# EAGLE design splitter (EAGLE 6.4)
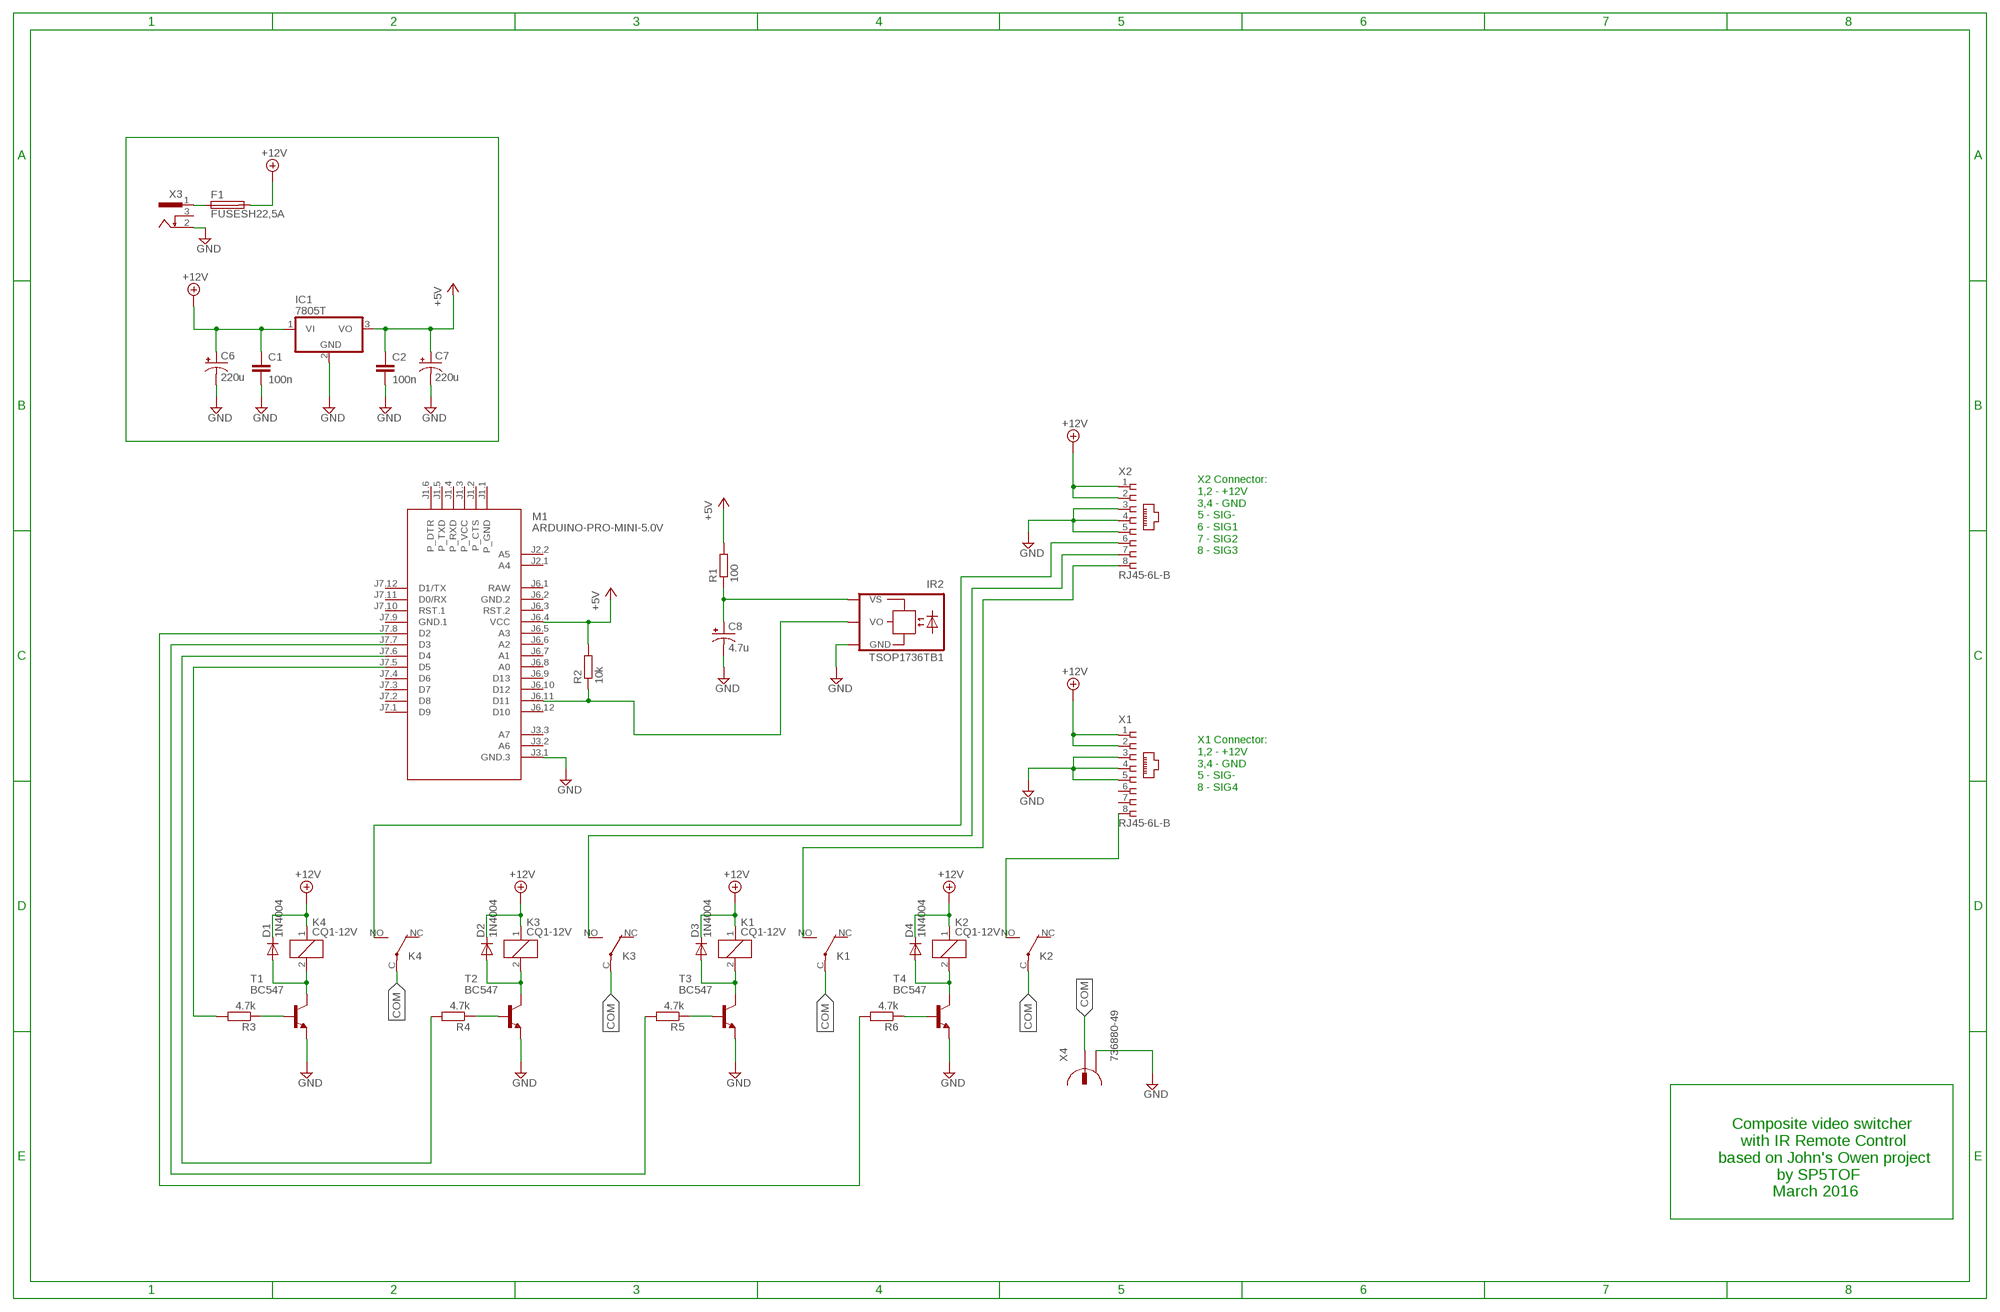
[diagram p0: schematic, sheet 1]

## Parts
C1  100n  C-EU025-024X044  [C025-024X044]
C2  100n  C-EU025-024X044  [C025-024X044]
C6  220u  CAP_POLPTH2  [CPOL-RADIAL-10UF-25V]
C7  220u  CAP_POLPTH2  [CPOL-RADIAL-10UF-25V]
C8  4.7u  CAP_POLPTH2  [CPOL-RADIAL-10UF-25V]
D1  1N4004  [DO41-10]
D2  1N4004  [DO41-10]
D3  1N4004  [DO41-10]
D4  1N4004  [DO41-10]
F1  FUSESH22,5A  [SH22,5A]
IC1  7805T  [TO220H]
IR2  TSOP1736TB1  [TSOP17_TB1]
K1  CQ1-12V  [CQ1]
K2  CQ1-12V  [CQ1]
K3  CQ1-12V  [CQ1]
K4  CQ1-12V  [CQ1]
M1  ARDUINO-PRO-MINI-5.0V  [ARDUINO-PRO-MINI]
R1  100  R-EU_0204/7  [0204/7]
R2  10k  R-EU_0204/7  [0204/7]
R3  4.7k  R-EU_0204/7  [0204/7]
R4  4.7k  R-EU_0204/7  [0204/7]
R5  4.7k  R-EU_0204/7  [0204/7]
R6  4.7k  R-EU_0204/7  [0204/7]
T1  BC547  [TO92]
T2  BC547  [TO92]
T3  BC547  [TO92]
T4  BC547  [TO92]
X1  RJ45-6L-B  [RJ45-NO-SHIELD]
X2  RJ45-6L-B  [RJ45-NO-SHIELD]
X3  733980-62  [733980-62]
X4  736880-49  [736880-49]

## Nets
+5V: C2.1 C7.1(+) IC1.3(VO) M1.J6.4(VCC) R1.2 R2.2
+12V: C1.1 C6.1(+) D1.C D2.C D3.C D4.C F1.2 IC1.1(VI) K1.1 K2.1 K3.1 K4.1 X1.1 X1.2 X2.1 X2.2
COM: K1.C(2:P) K2.C(2:P) K3.C(2:P) K4.C(2:P) X4.1
GND: C1.2 C2.2 C6.2(-) C7.2(-) C8.2(-) IC1.2(GND) IR2.GND M1.J3.1(GND.3) T1.1(E) T2.1(E) T3.1(E) T4.1(E) X1.3 X1.4 X1.5 X2.3 X2.4 X2.5 X3.2 X4.2
N$1: C8.1(+) IR2.VS R1.1
N$2: F1.1 X3.1
N$3: IR2.VO M1.J6.11(D11) R2.1
N$4: R3.1 T1.2(B)
N$5: R4.1 T2.2(B)
N$6: R5.1 T3.2(B)
N$7: R6.1 T4.2(B)
N$8: D1.A K4.2 T1.3(C)
N$9: M1.J7.7(D3) R5.2
N$10: M1.J7.6(D4) R4.2
N$11: D2.A K3.2 T2.3(C)
N$12: D3.A K1.2 T3.3(C)
N$13: D4.A K2.2 T4.3(C)
N$14: K4.NO(2:S) X2.6
N$15: K3.NO(2:S) X2.7
N$16: K1.NO(2:S) X2.8
N$17: K2.NO(2:S) X1.8
N$23: M1.J7.5(D5) R3.2
N$24: M1.J7.8(D2) R6.2
Unconnected: K1.NC(2:O) K2.NC(2:O) K3.NC(2:O) K4.NC(2:O) M1.J1.1(P_GND) M1.J1.2(P_CTS) M1.J1.3(P_VCC) M1.J1.4(P_RXD) M1.J1.5(P_TXD) M1.J1.6(P_DTR) M1.J2.1(A4) M1.J2.2(A5) M1.J3.2(A6) M1.J3.3(A7) M1.J6.3(RST.2) M1.J6.5(A3) M1.J6.6(A2) M1.J6.7(A1) M1.J6.8(A0) M1.J6.9(D13) M1.J6.10(D12) M1.J6.12(D10) M1.J7.1(D9) M1.J7.2(D8) M1.J7.3(D7) M1.J7.4(D6) M1.J7.10(RST.1) M1.J7.11(D0/RX) M1.J7.12(D1/TX) X1.6 X1.7 X3.3 X4.2@2

## Notes on the sheet
- X2 Connector:
  1,2 - +12V
  3,4 - GND
  5 - SIG-
  6 - SIG1
  7 - SIG2
  8 - SIG3
- X1 Connector:
  1,2 - +12V
  3,4 - GND
  5 - SIG-
  8 - SIG4
- Composite video switcher
          with IR Remote Control
     based on John's Owen project
                  by SP5TOF
                 March 2016

## Power pins joined to a net without a drawn wire
GND.1: M1.J7.9(GND.1)
GND.2: M1.J6.2(GND.2)
RAW: M1.J6.1(RAW)

## Library data of the parts
C1 C2 = rcl:C-EU: CAPACITOR, European symbol
C6-C8 = cyberdriver:CAP_POL: Capacitor Polarized These are standard SMD and PTH capacitors. Normally 10uF, 47uF, and 100uF in electrolytic and tantalum varieties. Always verify the external diameter of the through hole cap, it varies with capacity, voltage, and manufacturer. The EIA devices should be standard.
D1-D4 = diode:1N4004: DIODE general purpose rectifier, 1 A
F1 = fuse:FUSE: Fuse; OC_FARNELL: unknown; OC_NEWARK: unknown
IC1 = linear:78*: Positive VOLTAGE REGULATOR Source: http://cache.national.com/ds/LM/LM78L05.pdf http://www.fairchildsemi.com/ds/LM/LM7805.pdf
IR2 = telefunken:TSOP17*TB1: TSOP17..TB1 IR Receiver Modules for Remote Control Systems Source: http://www.vishay.com/docs/82042/82042.pdf; OC_FARNELL: unknown; OC_NEWARK: unknown
K1-K4 = relay:CQ1-12V: AUTOMOTIVE QUIET RELAY NAiS Source: http://www.mew-europe.com/.. en_ds_61208_0000.pdf; OC_FARNELL: unknown; OC_NEWARK: unknown
M1 = diy-modules:ARDUINO-PRO-MINI-*: Arduino Pro Mini
R1-R6 = rcl:R-EU_: RESISTOR, European symbol
T1-T4 = transistor:BC547: NPN TRANSISTOR
X1 X2 = con-tycoelectronics:RJ45: CORCOM Modular RJ Jacks No Shield Source: www.tycoelectronics.com .. ENG_DS_1654001_1099_RJ_L_0507.pdf; MPN: RJ45-6L-B; OC_FARNELL: unknown; OC_NEWARK: 16R6090
X3 = con-conrad:73398?: FEMALE PRINT CONNECTOR Niedervolt-Steckverbinder Distributor Conrad
X4 = con-conrad:736880-49: Cinch Connector ( RCA Jack )

## Board
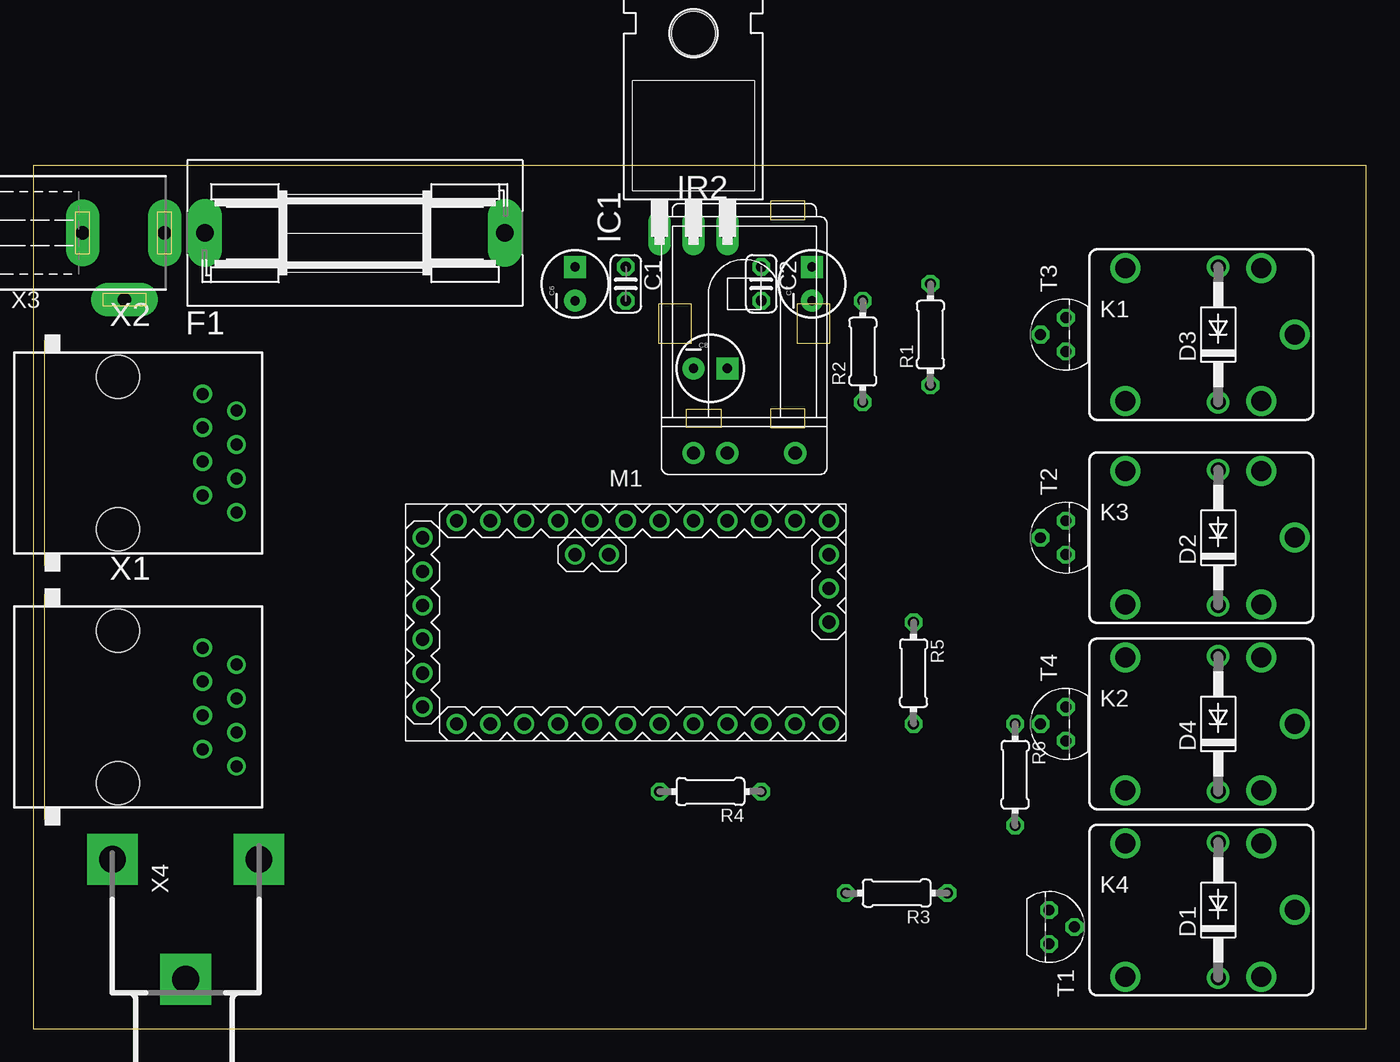
[diagram p1: board, top side]
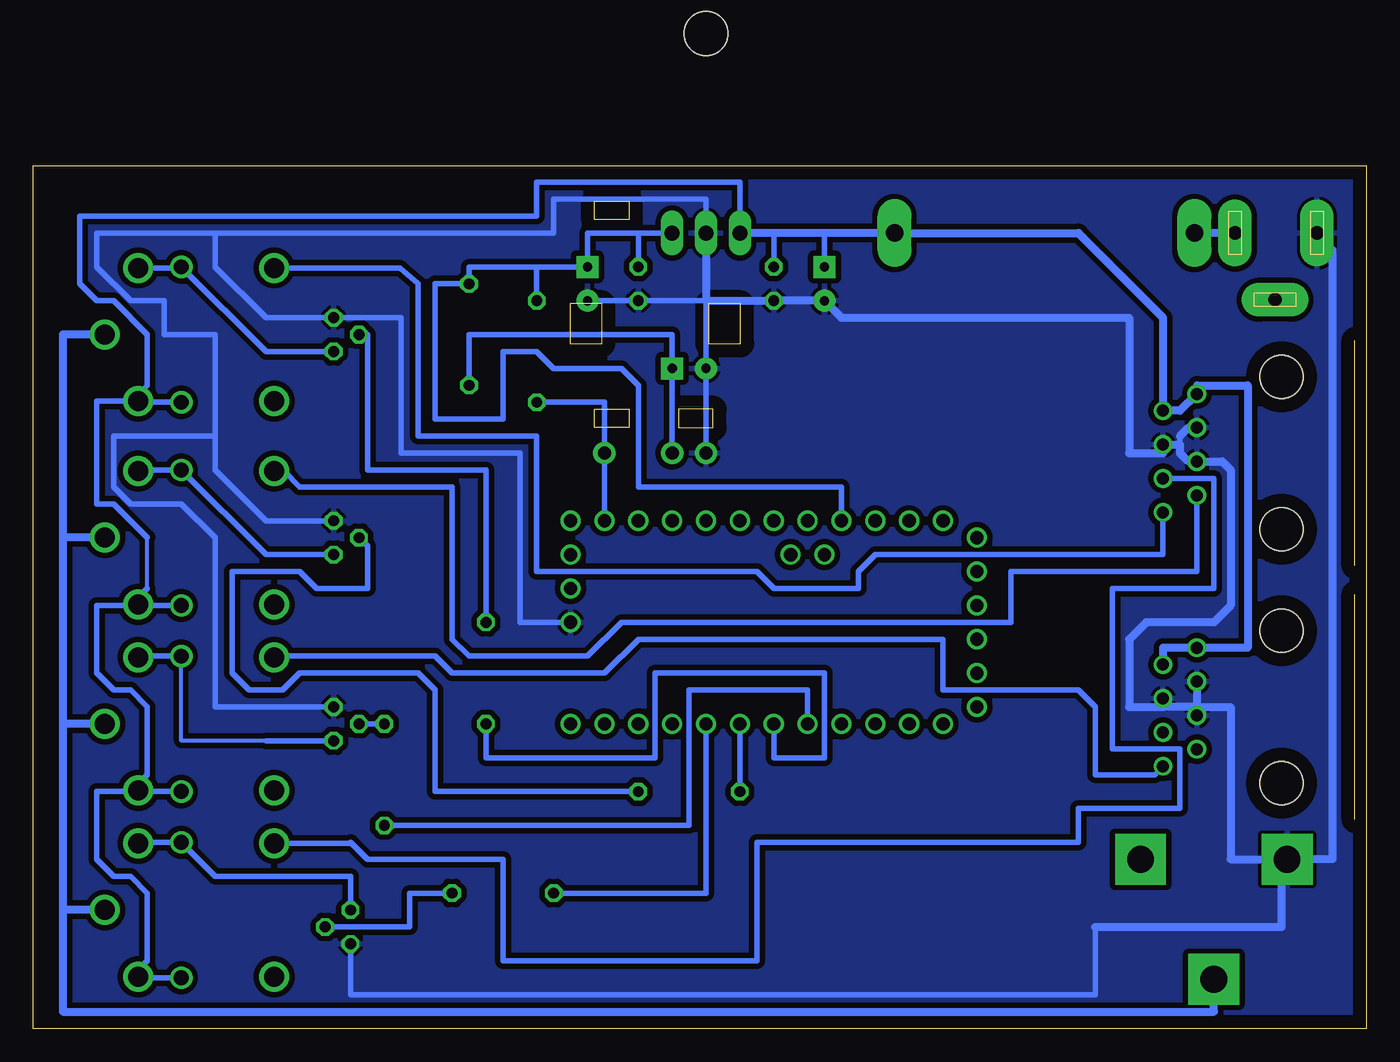
[diagram p2: board, bottom side, seen from below]

Size 100 x 64.76 mm. Coordinates in mm from the lower left corner, seen from the top.
Outline: 0,0 100,0 100,64.76 0,64.76 0,0
Copper layers (1*16): Top 0.035mm / dielectric 1.5mm / Bottom 0.035mm
Design rules "default": minimum track width 10mil, minimum drill 24mil, track to track 8mil, track to pad 8mil, pad to pad 8mil, via to via 8mil, smd to smd 8mil, copper to edge 40mil, drill to drill 8mil, minimum pad ring 10mil, minimum via ring 8mil, stop-mask expansion 4mil, vias tented up to drill 0mil, thermal gap 10mil

### Footprints (pad centres in the part's own frame; a part is rotated, then mirrored left to right if it is on the bottom)
C025-024X044 = drill 0.813 octagon: 1 -1.27,0; 2 1.27,0
CPOL-RADIAL-10UF-25V = drill 0.7 pad 1.651 square: 1 1.27,0 | drill 0.7 pad 1.651: 2 -1.27,0
DO41-10 = drill 1.118: A 5.08,0; C -5.08,0
SH22,5A = drill 1.321 pad 2.54 long: 1 -11.252,0; 2 11.252,0
TO220H = drill 1.118 long: 1 -2.54,-10.16; 2 0,-10.16; 3 2.54,-10.16 | hole 3.302: 0,4.826
TSOP17_TB1 = drill 1 pad 1.676: GND 0,-3.81; VO 0,3.81; VS 0,-1.27
CQ1 = drill 1.5: 1 4.5,-5; 2 4.5,5; C 7,0; NC -5.7,-5; NO -5.7,5
ARDUINO-PRO-MINI = drill 1: J1.1 -15.24,6.35; J1.2 -15.24,3.81; J1.3 -15.24,1.27; J1.4 -15.24,-1.27; J1.5 -15.24,-3.81; J1.6 -15.24,-6.35; J2.1 -1.27,5.08; J2.2 -3.81,5.08; J3.1 15.24,0; J3.2 15.24,2.54; J3.3 15.24,5.08; J6.1 -12.7,7.62; J6.2 -10.16,7.62; J6.3 -7.62,7.62; J6.4 -5.08,7.62; J6.5 -2.54,7.62; J6.6 0,7.62; J6.7 2.54,7.62; J6.8 5.08,7.62; J6.9 7.62,7.62; J6.10 10.16,7.62; J6.11 12.7,7.62; J6.12 15.24,7.62; J7.1 15.24,-7.62; J7.2 12.7,-7.62; J7.3 10.16,-7.62; J7.4 7.62,-7.62; J7.5 5.08,-7.62; J7.6 2.54,-7.62; J7.7 0,-7.62; J7.8 -2.54,-7.62; J7.9 -5.08,-7.62; J7.10 -7.62,-7.62; J7.11 -10.16,-7.62; J7.12 -12.7,-7.62
0204/7 = drill 0.813 octagon: 1 -3.81,0; 2 3.81,0
TO92 = drill 0.813 octagon: 1 1.27,0; 2 0,1.905; 3 -1.27,0
RJ45-NO-SHIELD = drill 0.9 pad 1.4: 1 -4.445,6.35; 2 -3.175,8.89; 3 -1.905,6.35; 4 -0.635,8.89; 5 0.635,6.35; 6 1.905,8.89; 7 3.175,6.35; 8 4.445,8.89 | hole 3.251: -5.715,0; 5.715,0
733980-62 = drill 1 pad 2.5 long: 1 0,8.57; 2 0,2.42; 3 5,5.57
736880-49 = drill 2 pad 3.81 square: 1 -3.92,0; 2 5.08,5.5; 2@2 5.08,-5.5

### Placement (x,y rotation side)
C1  44.45,55.88 270 top
C2  54.61,55.88 270 top
C6  40.64,55.88 90 top
C7  58.42,55.88 90 top
C8  50.8,49.53 0 top
D1  88.9,8.89 90 top
D2  88.9,36.83 90 top
D3  88.9,52.07 90 top
D4  88.9,22.86 90 top
F1  24.13,59.69 0 top
IC1  49.53,69.85 0 top
IR2  53.34,43.18 270 top
K1  87.63,52.07 0 top
K2  87.63,22.86 0 top
K3  87.63,36.83 0 top
K4  87.63,8.89 0 top
M1  44.45,30.48 0 top
R1  67.31,52.07 90 top
R2  62.23,50.8 90 top
R3  64.77,10.16 180 top
R4  50.8,17.78 180 top
R5  66.04,26.67 270 top
R6  73.66,19.05 270 top
T1  76.2,7.62 270 top
T2  77.47,36.83 90 top
T3  77.47,52.07 90 top
T4  77.47,22.86 90 top
X1  6.35,24.13 270 top
X2  6.35,43.18 270 top
X3  1.27,59.69 270 top
X4  11.43,7.62 90 top

### Tracks (layer width: path | path; a pad name or v marks a point on that pad's centre or on a via)
+5V
  Bottom 0.406: C2.1 54.61,59.69 | 54.61,59.69 IC1.3 | 54.61,59.69 58.42,59.69 C7.1 62.23,57.15 | 62.23,57.15 R2.2 | M1.J6.4 39.37,40.64 54.61,40.64 54.61,48.26 55.88,49.53 60.96,49.53 62.23,50.8 64.77,50.8 64.77,45.72 69.85,45.72 69.85,55.88 R1.2 67.31,57.15 62.23,57.15
+12V
  Bottom 0.305: 91.44,33.02 91.44,36.83
  Bottom 0.406: C1.1 44.45,59.69 | C6.1 40.64,59.69 | D3.C 92.13,46.99 K1.1 92.71,47.07 | D2.C 92.13,31.75 | D4.C 92.13,17.78 | D1.C 92.13,3.81 K4.1 92.13,4.39 91.44,5.08 91.44,10.16 92.71,11.43 93.98,11.43 95.25,12.7 95.25,17.78 92.13,17.78 | 92.71,47.07 95.25,47.07 95.25,39.37 93.98,39.37 91.44,36.83 | 91.44,33.02 92.13,32.33 K3.1 92.13,31.75 | 92.13,17.78 K2.1 92.13,18.36 91.44,19.05 91.44,24.13 92.71,25.4 93.98,25.4 95.25,26.67 95.25,31.75 92.13,31.75 | IC1.1 46.99,63.5 62.23,63.5 62.23,60.96 96.52,60.96 96.52,55.88 95.25,54.61 93.98,54.61 91.44,52.07 91.44,48.26 92.71,47.07
  Bottom 0.61: IC1.1 44.45,59.69 40.64,59.69 F1.2 21.59,59.69 15.24,53.34 X2.2 13.97,46.35 X2.1 12.7,48.26 8.89,48.26 8.89,28.57 X1.1 15.24,28.57 X1.2
COM
  Bottom 0.61: X4.1 11.43,1.27 97.79,1.27 97.79,8.89 | K1.C 97.79,52.07 97.79,36.83 | 97.79,36.83 97.79,22.86 | 97.79,22.86 97.79,8.89 | K4.C 97.79,8.89 | K2.C 97.79,22.86 | K3.C 97.79,36.83
GND
  Bottom 0.406: C7.2 C2.2 49.53,54.61 C8.2 IR2.GND | 86.36,59.69 86.36,57.15 82.55,53.34 T3.1 72.39,53.34 72.39,43.18 63.5,43.18 63.5,30.48 M1.J3.1 | IC1.2 49.53,62.23 60.96,62.23 60.96,59.69 86.36,59.69 | X3.2 3.69,59.57 | X2.5 13.34,42.55 | 13.97,43.81 13.97,44.45 | 15.24,43.18 X2.4 | T1.1 76.2,2.54 20.32,2.54 20.32,7.62 | 6.35,12.7 X4.2 | T2.1 82.55,38.1 86.36,41.91 86.36,44.45 | 86.36,44.45 86.36,52.07 90.17,52.07 90.17,54.61 92.71,54.61 95.25,57.15 95.25,59.69 86.36,59.69 | T4.1 86.36,24.13 86.36,36.83 88.9,39.37 92.71,39.37 93.98,40.64 93.98,44.45 86.36,44.45
  Bottom 0.61: IC1.2 49.53,54.61 C1.2 C6.2 39.37,53.34 17.78,53.34 17.78,43.18 15.24,43.18 | 3.69,59.57 2.54,58.42 2.54,12.7 X4.2 10.16,12.7 10.16,24.13 12.7,24.13 | X2.5 10.79,42.55 10.16,41.91 10.16,31.75 11.43,30.48 16.51,30.48 17.78,29.21 17.78,24.13 15.24,24.13 | 12.7,24.13 15.24,24.13 | X1.4 15.24,24.13 | X1.5 12.7,24.13 | X1.3 12.7,24.13 | 13.34,42.55 13.97,43.18 13.97,43.81 X2.4 | X2.3 13.34,45.09 13.97,44.45 | 20.32,7.62 6.35,7.62 6.35,12.7
  pour Bottom (isolate 0.406): 0,65 100,65 100,0 0,0
N$1
  Bottom 0.406: IR2.VS C8.1 52.07,52.07 67.31,52.07 R1.1
N$2
  Bottom 0.61: X3.1 F1.1
N$3
  Bottom 0.406: R2.1 57.15,46.99 IR2.VO M1.J6.11
N$4
  Bottom 0.406: R3.1 71.75,10.16 71.75,7.62 T1.2
N$5
  Bottom 0.406: R4.1 69.85,17.78 69.85,25.4 71.12,26.67 80.01,26.67 81.28,25.4 83.82,25.4 85.09,26.67 85.09,34.29 80.01,34.29 78.74,33.02 74.93,33.02 74.93,36.2 T2.2
N$6
  Bottom 0.406: T3.2 74.93,52.07 74.93,41.91 66.04,41.91 R5.1
N$7
  Bottom 0.406: T4.2 R6.1
N$8
  Bottom 0.406: K4.2 92.13,13.97 D1.A 86.36,11.43 76.2,11.43 T1.3
N$9
  Bottom 0.406: R5.2 66.04,20.32 53.34,20.32 53.34,26.67 40.64,26.67 40.64,20.32 44.45,20.32 M1.J7.7
N$10
  Bottom 0.406: M1.J7.6 R4.2
N$11
  Bottom 0.406: K3.2 92.13,41.91 D2.A 82.55,35.56 T2.3
N$12
  Bottom 0.406: K1.2 88.9,57.07 D3.A 82.55,50.8 T3.3
N$13
  Bottom 0.305: 82.55,21.59 88.9,21.59 D4.A
  Bottom 0.406: D4.A 92.13,27.94 K2.2 | 82.55,21.59 T4.3
N$14
  Bottom 0.406: X2.6 11.43,41.27 11.43,33.02 19.05,33.02 19.05,21 14,21 14,20.32 13.97,20.32 13.97,16.51 21.59,16.51 21.59,13.97 45.72,13.97 45.72,5.08 64.77,5.08 64.77,12.7 74.93,12.7 76.2,13.97 76.28,13.89 K4.NO
N$15
  Bottom 0.406: K3.NO 81.2,41.83 80.01,40.64 68.58,40.64 68.58,29.21 67.31,27.94 58.42,27.94 55.88,30.48 26.67,30.48 26.67,34.29 12.7,34.29 X2.7
N$16
  Bottom 0.406: K1.NO 72.47,57.07 71.12,55.88 71.12,44.45 62.23,44.45 62.23,34.29 45.72,34.29 44.45,33.02 38.1,33.02 38.1,34.29 36.83,35.56 15.24,35.56 X2.8
N$17
  Bottom 0.406: 81.93,27.94 K2.NO 81.85,27.94 69.85,27.94 68.58,26.67 57.15,26.67 54.61,29.21 31.75,29.21 31.75,25.4 21.59,25.4 20.32,24.13 20.32,19.05 15.88,19.05 X1.8
N$23
  Bottom 0.406: R3.2 49.53,10.16 M1.J7.5
N$24
  Bottom 0.406: R6.2 50.8,15.24 50.8,25.4 41.91,25.4 M1.J7.8